# EAGLE design lithium (EAGLE 7.7.0)
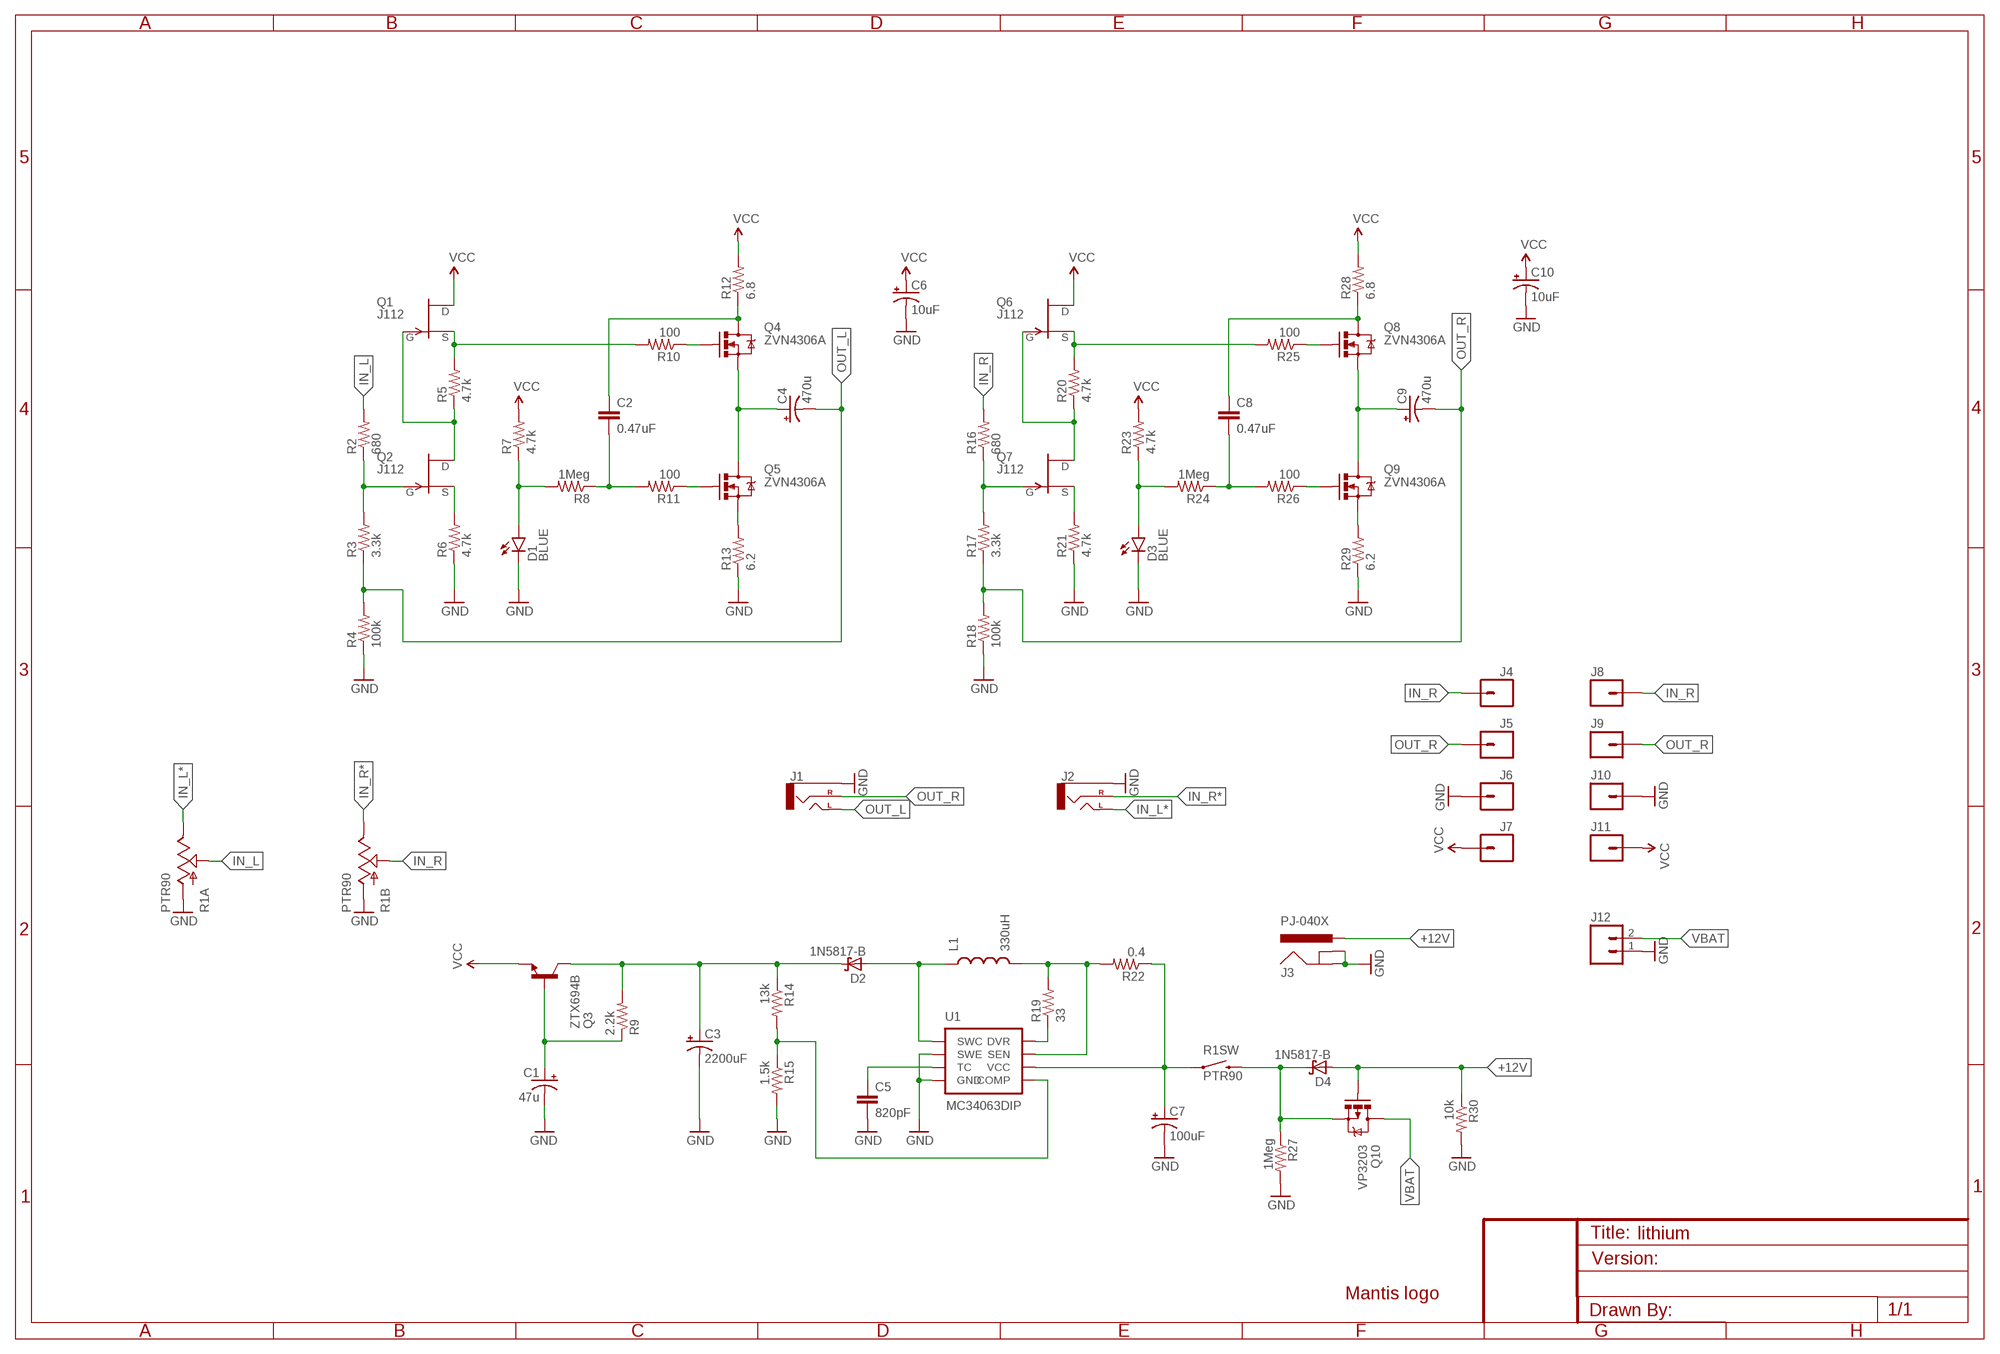
[diagram p0: schematic, sheet 1]

## Parts
C1  47u  CAP_POLPTH1-SM  [CPOL-RADIAL-10UF-25V-SM]
C2  0.47uF  C5/3.5  [C5B3.5]
C3  2200uF  CAP_POLPTH4  [CPOL-RADIAL-1000UF-25V]
C4  470u  CAP_POLPTH8MM  [CPOL-RADIAL-8/3.5]
C5  820pF  CAPPTH  [CAP-PTH-SMALL]
C6  10uF  CAP_POLPTH1-SM  [CPOL-RADIAL-10UF-25V-SM]
C7  100uF  CAP_POLPTH1  [CPOL-RADIAL-100UF-25V]
C8  0.47uF  C5/3.5  [C5B3.5]
C9  470u  CAP_POLPTH8MM  [CPOL-RADIAL-8/3.5]
C10  10uF  CAP_POLPTH1-SM  [CPOL-RADIAL-10UF-25V-SM]
D1  BLUE  LED3MM-SM  [LED3MM-SM]
D2  1N5817-B  [DO41-7.6]
D3  BLUE  LED3MM-SM  [LED3MM-SM]
D4  1N5817-B  [DO41-7.6]
J1  AUDIO-JACKPTH  [AUDIO-JACK]
J2  AUDIO-JACKPTH  [AUDIO-JACK]
J3  PJ-040X  [PJ-040X]
J4  M01PTH  [1X01]
J5  M01PTH  [1X01]
J6  M01PTH  [1X01]
J7  M01PTH  [1X01]
J8  M01PTH  [1X01]
J9  M01PTH  [1X01]
J10  M01PTH  [1X01]
J11  M01PTH  [1X01]
J12  M02PTH  [1X02]
L1  330uH  INDUCTORRLB0912  [RLB0912]
LOGO1  LOGO-MANTIS  [LOGO-MANTIS]
Q1  J112  [TO-92]
Q2  J112  [TO-92]
Q3  ZTX694B  [TO-92]
Q4  ZVN4306A  [TO-92]
Q5  ZVN4306A  [TO-92]
Q6  J112  [TO-92]
Q7  J112  [TO-92]
Q8  ZVN4306A  [TO-92]
Q9  ZVN4306A  [TO-92]
Q10  VP3203  [TO-92]
R1  PTR90  [PTR902]
R2  680  RESISTORPTH-1/4W-SM  [AXIAL-0.4-SM]
R3  3.3k  RESISTORPTH-1/4W-SM  [AXIAL-0.4-SM]
R4  100k  RESISTORPTH-1/4W-SM  [AXIAL-0.4-SM]
R5  4.7k  RESISTORPTH-1/4W-SM  [AXIAL-0.4-SM]
R6  4.7k  RESISTORPTH-1/4W-SM  [AXIAL-0.4-SM]
R7  4.7k  RESISTORPTH-1/4W-SM  [AXIAL-0.4-SM]
R8  1Meg  RESISTORPTH-1/4W-SM  [AXIAL-0.4-SM]
R9  2.2k  RESISTORPTH-1/4W-SM  [AXIAL-0.4-SM]
R10  100  RESISTORPTH-1/4W-SM  [AXIAL-0.4-SM]
R11  100  RESISTORPTH-1/4W-SM  [AXIAL-0.4-SM]
R12  6.8  RESISTORPTH-1/4W-SM  [AXIAL-0.4-SM]
R13  6.2  RESISTORPTH-1/4W-SM  [AXIAL-0.4-SM]
R14  13k  RESISTORPTH-1/4W-SM  [AXIAL-0.4-SM]
R15  1.5k  RESISTORPTH-1/4W-SM  [AXIAL-0.4-SM]
R16  680  RESISTORPTH-1/4W-SM  [AXIAL-0.4-SM]
R17  3.3k  RESISTORPTH-1/4W-SM  [AXIAL-0.4-SM]
R18  100k  RESISTORPTH-1/4W-SM  [AXIAL-0.4-SM]
R19  33  RESISTORPTH-1/4W-SM  [AXIAL-0.4-SM]
R20  4.7k  RESISTORPTH-1/4W-SM  [AXIAL-0.4-SM]
R21  4.7k  RESISTORPTH-1/4W-SM  [AXIAL-0.4-SM]
R22  0.4  RESISTORPTH-1/4W-SM  [AXIAL-0.4-SM]
R23  4.7k  RESISTORPTH-1/4W-SM  [AXIAL-0.4-SM]
R24  1Meg  RESISTORPTH-1/4W-SM  [AXIAL-0.4-SM]
R25  100  RESISTORPTH-1/4W-SM  [AXIAL-0.4-SM]
R26  100  RESISTORPTH-1/4W-SM  [AXIAL-0.4-SM]
R27  1Meg  RESISTORPTH-1/4W-SM  [AXIAL-0.4-SM]
R28  6.8  RESISTORPTH-1/4W-SM  [AXIAL-0.4-SM]
R29  6.2  RESISTORPTH-1/4W-SM  [AXIAL-0.4-SM]
R30  10k  RESISTORPTH-1/4W-SM  [AXIAL-0.4-SM]
U1  MC34063DIP  [DIP-08]

## Nets
+12V [pwr]: D4.A J3.1(PWR) Q10.2(G) R30.P$1
GND: C1.2(-) C3.- C5.2 C6.2(-) C7.2(-) C10.2(-) D1.K(C) D3.K(C) J1.SLEEVE J2.SLEEVE J3.2(GND) J3.3(GNDBREAK) J6.1 J10.1 J12.1 R1.R1.1(A:A) R1.R2.1(B:A) R4.P$1 R6.P$1 R13.P$1 R15.P$2 R18.P$1 R21.P$1 R27.P$2 R29.P$1 R30.P$2 U1.2(SWE) U1.4(GND)
IN_L: R1.R1.2(A:S) R2.P$2
IN_L*: J2.TIP(LEFT) R1.R1.3(A:E)
IN_R: J4.1 J8.1 R1.R2.2(B:S) R16.P$2
IN_R*: J2.RING(RIGHT) R1.R2.3(B:E)
N$1: Q1.2(S) R5.P$2 R10.P$2
N$2: Q1.3(G) Q2.1(D) R5.P$1
N$3: Q2.2(S) R6.P$2
N$4: Q6.2(S) R20.P$2 R25.P$2
N$5: Q4.2(G) R10.P$1
N$6: Q2.3(G) R2.P$1 R3.P$2
N$7: Q6.3(G) Q7.1(D) R20.P$1
N$8: Q5.2(G) R11.P$1
N$9: C5.1 U1.3(TC)
N$10: Q5.1(S) R13.P$2
N$11: C2.1 Q4.3(D) R12.P$1
N$12: Q7.2(S) R21.P$2
N$13: C2.2 R8.P$1 R11.P$2
N$14: D1.A R7.P$1 R8.P$2
N$15: Q7.3(G) R16.P$1 R17.P$2
N$16: Q8.2(G) R25.P$1
N$17: Q9.2(G) R26.P$1
N$18 [pwr]: R19.P$1 U1.8(DVR)
N$19: Q9.1(S) R29.P$2
N$20: C8.1 Q8.3(D) R28.P$1
N$21: C8.2 R24.P$1 R26.P$2
N$22: D3.A R23.P$1 R24.P$2
N$23 [pwr]: C7.1(+) R1.SW1 R22.P$1 U1.6(VCC)
N$24: C1.1(+) Q3.2(B) R9.P$1
N$25 [pwr]: D2.A L1.1 U1.1(SWC)
N$26 [pwr]: L1.2 R19.P$2 R22.P$2 U1.7(SEN)
N$28: R14.P$2 R15.P$1 U1.5(COMP)
N$29 [pwr]: D4.C Q10.1(S) R1.SW2 R27.P$1
OUT_L: C4.2(-) J1.TIP(LEFT) R3.P$1 R4.P$2
OUT_L*: C4.1(+) Q4.1(S) Q5.3(D)
OUT_R: C9.2(-) J1.RING(RIGHT) J5.1 J9.1 R17.P$1 R18.P$2
OUT_R*: C9.1(+) Q8.1(S) Q9.3(D)
VBAT [pwr]: J12.2 Q10.3(D)
VCC [pwr]: C6.1(+) C10.1(+) J7.1 J11.1 Q1.1(D) Q3.1(E) Q6.1(D) R7.P$2 R12.P$2 R23.P$2 R28.P$2
VSMPS [pwr]: C3.+ D2.C Q3.3(C) R9.P$2 R14.P$1

## Library data of the parts
C1 C4 C6 C9 C10 = my-cap:CAP_POL: Capacitor Polarized These are standard SMD and PTH capacitors. Normally 10uF, 47uF, and 100uF in electrolytic and tantalum varieties. Always verify the external diameter of the through hole cap, it varies with capacity, voltage, and manufacturer. The EIA devices should be standard.
C2 C8 = capacitor-wima:C: CAPACITOR naming: grid - package width
C3 C7 = SparkFun-Capacitors:CAP_POL: Capacitor Polarized These are standard SMD and PTH capacitors. Normally 10uF, 47uF, and 100uF in electrolytic and tantalum varieties. Always verify the external diameter of the through hole cap, it varies with capacity, voltage, and manufacturer. The EIA devices should be standard.
C5 = SparkFun-Capacitors:CAP: Capacitor Standard 0603 ceramic capacitor, and 0.1" leaded capacitor.
D1 D3 = my:LED: LEDs Standard schematic elements and footprints for 5mm, 3mm, 1206, and 0603 sized LEDs. 5mm - Spark Fun Electronics SKU : COM-00529 (and others)
D2 D4 = diode:1N581*: 1.0A SCHOTTKY BARRIER RECTIFIER Source: http://www.diodes.com/datasheets/ds23001.pdf
J1 J2 = SparkFun-Connectors:AUDIO-JACK: 3.5mm Audio Jack Simple 3.5mm common PCB mount audio jack. Variant PTH is our storefront SKU PRT-08032
J3 = my-conn:PJ-040X: CUI PJ-040x 3.8mm power jack
J4-J11 = SparkFun-Connectors:M01: Header 1 Standard 1-pin 0.1" header. Use with straight break away headers (SKU : PRT-00116), right angle break away headers (PRT-00553), swiss pins (PRT-00743), machine pins (PRT-00117), and female headers (PRT-00115). SMTSO-256-ET is a "flush mount" nut for a 4-40 screw. The older package used to be too tight, and did not allow it to sit properly thru the drill hit. The latest (0.165DIA) fits nice and snug.
J12 = SparkFun-Connectors:M02: Standard 2-pin 0.1" header. Use with - straight break away headers ( PRT-00116) - right angle break away headers (PRT-00553) - swiss pins (PRT-00743) - machine pins (PRT-00117) - female headers (PRT-00115) Molex polarized connector foot print use with: PRT-08233 with associated crimp pins and housings. 2.54_SCREWTERM for use with PRT-10571. 3.5mm Screw Terminal footprints for PRT-08084 5mm Screw Terminal footprints for use with PRT-08432
L1 = SparkFun-Passives:INDUCTOR: Inductors Basic Inductor/Choke - 0603 and 1206. Footprints are not proven and vary greatly between part numbers. INDUCTOR POWER 3.3UH 4.0A SMD 0.197" L x 0.197" W x 0.177" H (5.00mm x 5.00mm x 4.50mm)
LOGO1 = my:LOGO-MANTIS: Mantis logo
Q1 Q2 Q6 Q7 = my-tran:J112
Q3 = my-tran:ZTX694B: NPN TRANSISTOR
Q4 Q5 Q8 Q9 = my-tran:ZVN4306A
Q10 = my-tran:VP3203: P-Channel Enhancement-Mode Vertical DMOS FET
R1 = my:PTR90: PTD90 Series - 9 mm Multi-Ganged Potentiometer
R2-R30 = my-res:RESISTOR: Resistor Basic schematic elements and footprints for 0603, 1206, and PTH resistors.
U1 = SparkFun-PowerIC:MC34063: Jellybean switching supply controller

## Net classes
1 pwr: width 0.61 mm

## Board
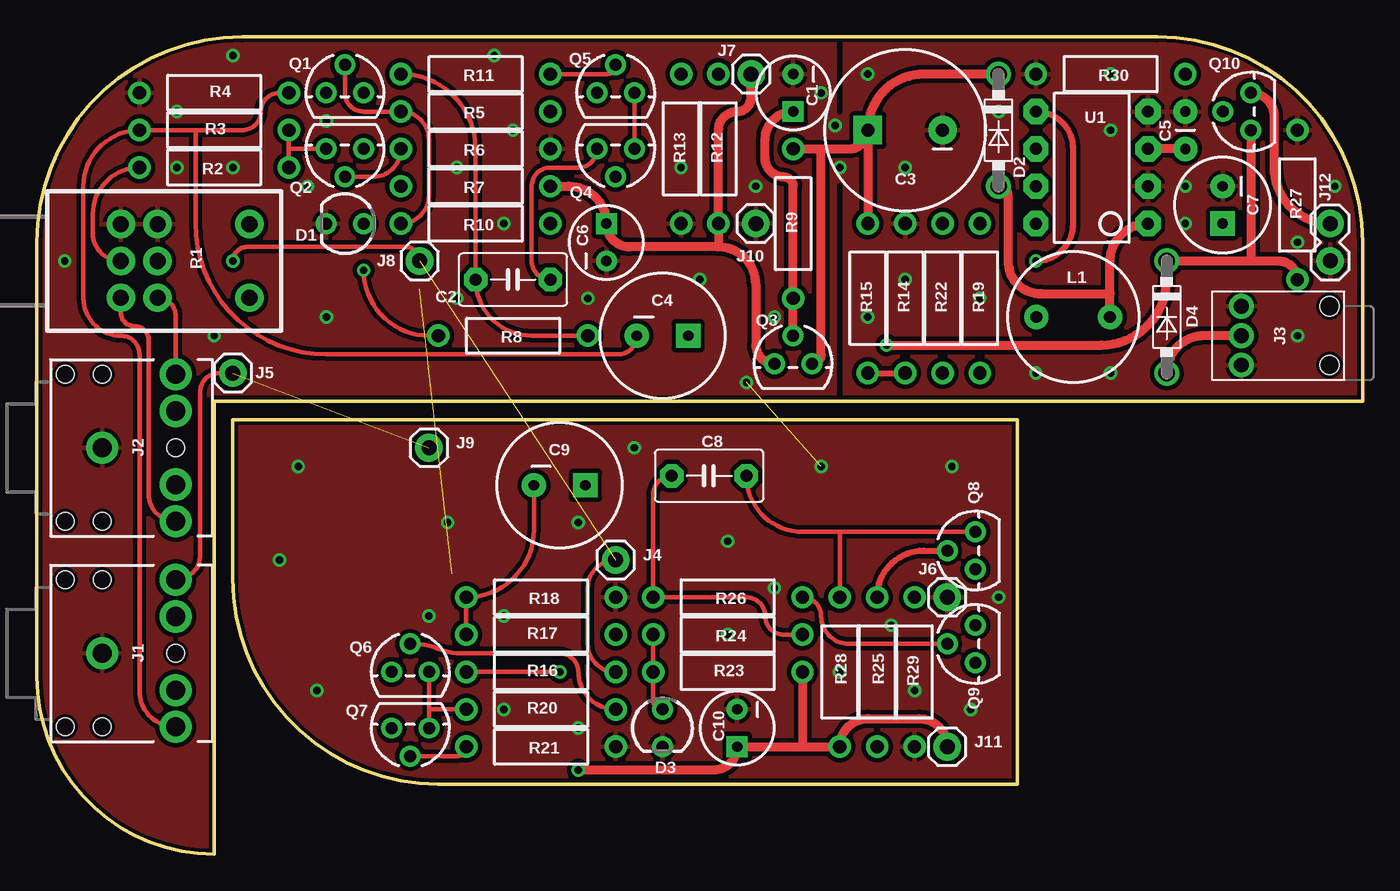
[diagram p1: board, top side]
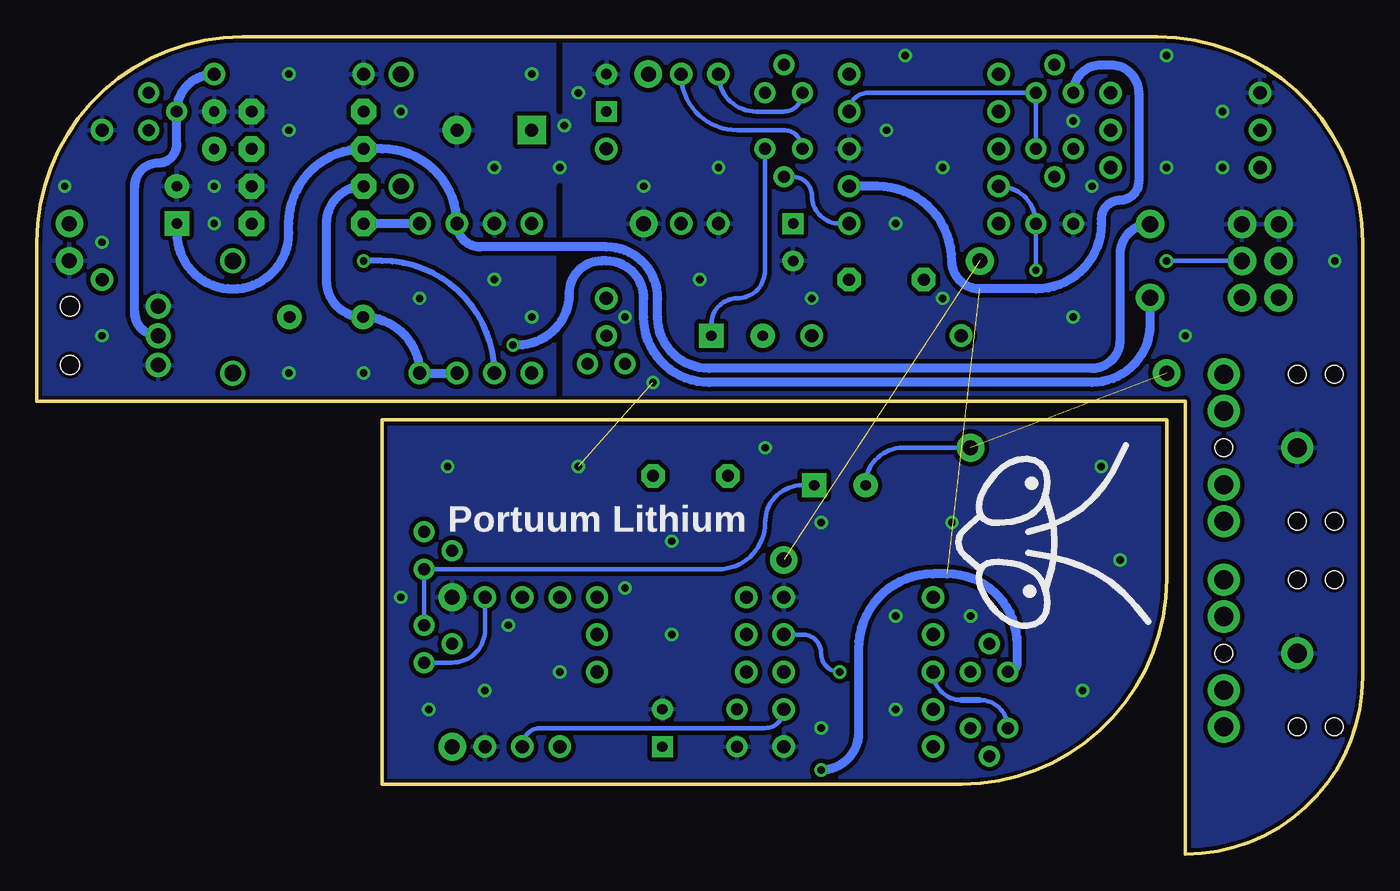
[diagram p2: board, bottom side, seen from below]

Size 90.17 x 55.56 mm. Coordinates in mm from the lower left corner, seen from the top.
Outline: 90.17,30.8 90.17,41.59 arc90 76.2,55.56 13.97,55.56 arc90 0,41.59 0,12.07 arc90 12.06,0 12.06,30.8 90.17,30.8
Outline: 66.67,4.76 27.3,4.76 arc-90 13.34,18.73 13.34,29.53 66.67,29.53 66.67,4.76
Copper layers (1*16): Top 0.035mm / dielectric 1.5mm / Bottom 0.035mm
Design rules "SeeedStudio_2layer_DRU_no_angle_20140221 *": minimum track width 6mil, minimum drill 12mil, track to track 12mil, track to pad 12mil, pad to pad 12mil, via to via 12mil, smd to smd 0mil, copper to edge 10mil, drill to drill 12mil, minimum pad ring 10mil, minimum via ring 8mil, stop-mask expansion 2mil, vias tented up to drill 100mil, thermal gap 10mil
tRestrict: 2 lines
bRestrict: 2 lines

### Footprints (pad centres in the part's own frame; a part is rotated, then mirrored left to right if it is on the bottom)
CPOL-RADIAL-10UF-25V-SM = drill 0.7 pad 1.422 square: 1 1.27,0 | drill 0.7 pad 1.422: 2 -1.27,0
C5B3.5 = drill 0.813 pad 1.6 octagon: 1 -2.54,0; 2 2.54,0
CPOL-RADIAL-1000UF-25V = drill 0.9 pad 1.93 square: + 2.54,0 | drill 0.9 pad 1.93: - -2.54,0
CPOL-RADIAL-8/3.5 = drill 0.7 pad 1.651 square: 1 1.75,0 | drill 0.7 pad 1.651: 2 -1.75,0
CAP-PTH-SMALL = drill 0.7 pad 1.651: 1 0,0; 2 2.54,0
CPOL-RADIAL-100UF-25V = drill 0.7 pad 1.651 square: 1 1.27,0 | drill 0.7 pad 1.651: 2 -1.27,0
LED3MM-SM = drill 0.813 pad 1.422: A -1.27,0; K 1.27,0
DO41-7.6 = drill 1.1 pad 1.7: A 3.81,0; C -3.81,0
AUDIO-JACK = drill 1.3 pad 2.184: RING 5,5; RSH 5,2.5; SLEEVE 0,0; TIP 5,-5; TSH 5,-2.5 | hole 1.2: 0,5; -2.5,5; -2.5,-5; 0,-5; 5,0
PJ-040X = drill 1 pad 1.676: 1 0,0; 2 0,-2; 3 0,2 | hole 1.3: -6,2; -6,-2
1X01 = drill 1.016 pad 1.88: 1 0,0
1X02 = drill 1.016 pad 1.88: 1 0,0; 2 2.54,0
RLB0912 = drill 0.813 pad 1.651: 1 2.502,0; 2 -2.502,0
TO-92 = drill 0.813 pad 1.422: 1 -1.27,0; 2 0,1.905; 3 1.27,0
PTR902 = drill 1.1 pad 1.93: R1.1 0,-2.5; R1.2 0,0; R1.3 0,2.5; R2.1 -2.5,-2.5; R2.2 -2.5,0; R2.3 -2.5,2.5; SW1 -8.75,-2.5; SW2 -8.75,2.5
AXIAL-0.4-SM = drill 0.9 pad 1.524: P$1 -5.08,0; P$2 5.08,0
DIP-08 = drill 0.813 pad 1.727 octagon: 1 -3.81,-3.81; 2 -1.27,-3.81; 3 1.27,-3.81; 4 3.81,-3.81; 5 3.81,3.81; 6 1.27,3.81; 7 -1.27,3.81; 8 -3.81,3.81

### Placement (x,y rotation side)
C1  51.44,51.75 270 top
C2  32.39,39.05 180 top
C3  59.05,49.21 180 top
C4  42.55,35.24 0 top
C5  78.1,47.94 90 top
C6  38.73,41.59 90 top
C7  80.64,44.13 270 top
C8  45.72,25.72 180 top
C9  35.56,25.08 0 top
C10  47.62,8.57 270 top
D1  20.95,42.86 180 top
D2  65.41,49.21 270 top
D3  42.55,8.57 270 top
D4  76.83,36.51 270 top
J1  4.45,13.65 0 top
J2  4.45,27.62 0 top
J3  81.91,35.24 180 top
J4  39.37,20 0 top
J5  13.34,32.7 0 top
J6  61.91,17.46 0 top
J7  48.58,53.02 0 top
J8  26.04,40.32 0 top
J9  26.67,27.62 0 top
J10  48.9,42.86 0 top
J11  61.91,7.3 0 top
J12  87.95,40.32 90 top
L1  70.48,36.51 0 top
LOGO1  20.95,21.27 270 bottom
Q1  20.95,51.75 0 top
Q2  20.95,47.94 180 top
Q3  51.44,33.34 0 top
Q4  39.37,47.94 180 top
Q5  39.37,51.75 0 top
Q6  25.4,12.38 0 top
Q7  25.4,8.57 180 top
Q8  63.82,20.64 90 top
Q9  63.82,14.29 90 top
Q10  82.55,50.48 90 top
R1  5.71,40.32 180 top
R2  12.06,46.67 180 top
R3  12.06,49.21 0 top
R4  12.06,51.75 0 top
R5  29.84,50.48 180 top
R6  29.84,47.94 180 top
R7  29.84,45.4 0 top
R8  32.39,35.24 180 top
R9  51.44,42.86 90 top
R10  29.84,42.86 180 top
R11  29.84,53.02 180 top
R12  46.36,47.94 270 top
R13  43.82,47.94 90 top
R14  56.52,37.78 270 top
R15  59.05,37.78 90 top
R16  34.29,12.38 0 top
R17  34.29,14.92 0 top
R18  34.29,17.46 180 top
R19  64.13,37.78 270 top
R20  34.29,9.84 0 top
R21  34.29,7.3 180 top
R22  61.59,37.78 270 top
R23  46.99,12.38 0 top
R24  46.99,14.92 180 top
R25  57.15,12.38 270 top
R26  46.99,17.46 180 top
R27  85.72,44.13 90 top
R28  54.61,12.38 270 top
R29  59.69,12.38 90 top
R30  73.02,53.02 180 top
U1  71.75,46.67 90 top

### Tracks (layer width: path | path; a pad name or v marks a point on that pad's centre or on a via)
+12V
  Top 0.61: J3.1 79.38,35.24 arc90 D4.A
  Bottom 0.61: J3.1 arc90 83.5,36.83 83.5,45.4 arc90 81.91,46.99 arc-90 80.64,48.26 Q10.2 arc90 R30.P$1
GND  (via drill 0.5)  (1 unrouted)
  other vias: 19.68,36.51 13.34,54.29 9.53,50.48 9.53,46.67 13.34,46.67 12.06,35.24 1.91,40.32 28.57,37.78 37.47,37.78 45.09,39.05 43.82,46.67 48.9,45.4 32.39,49.21 28.57,46.67 31.11,54.29 53.34,51.75 56.52,53.02 59.05,46.67 78.1,45.4 78.1,42.86 73.02,49.21 73.02,53.02 64.13,37.78 59.05,39.05 56.52,36.51 67.94,32.7 73.02,32.7 85.72,35.24 88.27,45.4 65.41,50.48 19.05,11.11 17.78,26.35 27.94,22.54 16.51,20 36.83,22.54 40.64,27.62 53.34,26.35 62.23,26.35 46.99,21.27 46.99,14.92 50.16,18.1 54.61,12.38 63.5,9.84 65.41,17.46 59.69,11.11 58.1,15.56 36.83,8.57 31.75,9.84 31.75,16.19 26.67,16.19 18.41,45.4 19.68,49.85 31.75,42.86 48.26,32.07 50.16,36.51 54.61,46.67 54.29,49.53 85.72,41.59
  pour Top: -0.64,82.23 90.8,82.23 90.8,-0.32 -0.64,-0.32
  pour Bottom: -0.64,82.23 90.8,82.23 90.8,-0.32 -0.64,-0.32
IN_L
  Top 0.305: R1.R1.2 arc-90 3.81,42.23 3.81,43.5 arc-90 R2.P$2
IN_L*
  Top 0.305: J2.TIP arc-90 7.62,24.45 7.62,34.92 arc90 6.67,35.88 arc-90 5.71,36.83 R1.R1.3
IN_R  (via drill 0.5)  (1 unrouted)
  Top 0.305: R16.P$2 arc-90 37.47,14.29 37.47,18.1 arc-90 J4.1 | J8.1 arc90 25.08,41.28 14.29,41.28 arc90 v13.34,40.32
  Bottom 0.305: v13.34,40.32 R1.R2.2
IN_R*
  Top 0.305: J2.RING 9.45,36.59 arc90 R1.R2.3
N$1
  Top 0.305: R10.P$2 arc90 26.67,44.77 26.67,48.58 arc90 R5.P$2 22.22,50.48 arc-90 20.95,51.75 Q1.2
N$2
  Bottom 0.305: Q2.1 Q1.3 33.66,51.75 arc-90 R5.P$1
N$3
  Top 0.305: Q2.2 22.86,46.04 arc90 R6.P$2
N$4
  Top 0.305: 25.72,14.29 arc-23 27.3,13.97 arc26 29.21,13.65 35.56,13.65 arc-90 36.83,12.38 arc90 R20.P$2
  Top 0.406: Q6.2 25.72,14.29
  Bottom 0.305: R20.P$2 arc90 40.64,8.57 55.88,8.57 arc-90 R25.P$2
N$5
  Bottom 0.305: R10.P$1 35.56,42.86 arc90 37.47,44.77 arc-90 38.73,46.04 Q4.2
N$6
  Top 0.305: R3.P$2 17.14,47.94 | 17.14,47.94 R2.P$1 | Q2.3 17.14,47.94
N$7
  Top 0.305: Q6.3 26.67,9.84 | 26.67,9.84 Q7.1 | R20.P$1 26.67,9.84
N$8
  Top 0.305: R11.P$1 38.73,53.02 arc90 Q5.2
N$9
  Top 0.61: C5.1 U1.3
N$10
  Bottom 0.305: Q5.1 arc90 39.37,50.48 41.27,50.48 arc90 R13.P$2
N$11
  Top 0.305: Q4.3 arc-90 36.83,46.67 34.93,46.67 arc90 33.66,45.4 33.66,40.32 arc90 C2.1
  Bottom 0.305: Q4.3 arc-90 39.37,49.21 42.55,49.21 arc90 R12.P$1
N$12
  Top 0.305: Q7.2 28.57,6.67 arc90 R21.P$2
N$13
  Top 0.305: R8.P$1 33.66,35.24 arc-90 C2.2 29.84,47.94 arc90 R11.P$2
N$14  (via drill 0.5)
  Top 0.305: v22.22,39.69 arc90 26.67,35.24 R8.P$2
  Bottom 0.305: v22.22,39.69 D1.A arc-90 R7.P$1
N$15  (via drill 0.5)
  Top 0.305: v35.56,12.38 R16.P$1
  Bottom 0.305: Q7.3 arc-90 26.04,10.48 | 27.3,10.48 arc90 R16.P$1 | v35.56,12.38 arc90 36.83,13.65 arc-90 38.1,14.92 R17.P$2
  Bottom 0.406: 26.04,10.48 27.3,10.48
N$16
  Top 0.406: R25.P$1 arc-90 60.33,20.64 Q8.2
N$17
  Top 0.305: R26.P$1 arc-90 53.34,16.19 arc90 55.25,14.29 Q9.2
N$18
  Bottom 0.61: R19.P$1 U1.8
N$19
  Bottom 0.305: R29.P$2 59.69,15.24 arc90 61.91,13.02 Q9.1
N$20
  Top 0.305: C8.1 arc90 52.07,21.91 54.61,21.91 | 54.61,21.91 Q8.3 | R28.P$1 54.61,21.91
N$21
  Top 0.305: R24.P$1 50.8,14.92 arc-90 49.53,16.19 arc90 48.26,17.46 R26.P$2 41.91,24.45 arc-90 C8.2
N$22
  Top 0.305: R24.P$2 R23.P$1 41.91,10.48 arc90 D3.A
N$23
  Bottom 0.61: R1.SW1 arc-90 16.51,40.78 16.51,34.92 arc90 18.41,33.02 44.45,33.02 arc90 47.94,36.51 47.94,37.78 arc-90 51.44,41.28 60.01,41.28 arc90 R22.P$1 arc-90 66.67,47.94 U1.6 arc-90 73.02,42.86 73.02,42.23 arc90 76.83,38.42 arc90 80.64,42.23 C7.1
N$24
  Top 0.61: Q3.2 R9.P$1 51.44,45.4 arc90 50.8,46.04 arc-90 49.53,47.31 49.53,48.58 arc-90 C1.1
N$25
  Top 0.61: L1.1 72.99,38.1 | 72.99,38.1 72.99,40.28 arc-90 U1.1 | D2.A arc-90 66.04,44.77 66.04,40.32 arc90 68.26,38.1 72.99,38.1
N$26
  Top 0.61: 67.94,36.51 L1.2
  Bottom 0.61: U1.7 arc-90 70.48,42.86 70.48,39.01 arc-90 L1.2 67.94,36.51 arc90 R19.P$2 R22.P$2
N$28  (via drill 0.5)
  Top 0.406: R14.P$2 R15.P$1 | v67.94,40.32 arc90 70.48,42.86 70.48,47.94 arc90 U1.5
  Bottom 0.406: R15.P$1 arc-90 66.67,40.32 v67.94,40.32
N$29  (via drill 0.5)
  Top 0.61: 82.55,40.32 D4.C 76.83,39.05 arc-90 72.39,34.61 v57.79,34.61 | 82.55,40.32 84.45,40.32 arc-90 R27.P$1 | Q10.1 82.55,40.32
  Bottom 0.61: R1.SW2 14.46,36.02 arc90 18.41,32.07 44.45,32.07 arc90 48.9,36.51 48.9,37.78 arc-90 51.44,40.32 51.75,40.32 arc-90 53.98,38.1 arc90 57.47,34.61 v57.79,34.61
OUT_L
  Top 0.305: J1.TIP arc-90 6.99,11.11 6.99,33.97 arc90 5.71,35.24 arc-90 3.17,37.78 3.17,45.4 arc-90 R3.P$1 10.79,49.21 | 10.79,49.21 13.97,49.21 arc90 15.24,50.48 arc-90 16.51,51.75 R4.P$2 | C4.2 arc-90 39.52,33.97 19.68,33.97 arc-90 10.79,42.86 10.79,49.21
OUT_L*
  Top 0.305: Q4.1 Q5.3
  Bottom 0.305: Q4.1 40.64,39.69 arc90 42.55,37.78 arc-90 44.3,36.03 C4.1
OUT_R  (1 unrouted)
  Top 0.305: C9.2 33.81,22.06 arc-90 R18.P$2 R17.P$1 | J1.RING arc90 11.11,20.32 11.11,31.43 arc-90 12.38,32.7 J5.1
  Bottom 0.305: J9.1 31.27,27.62 arc-90 C9.2
OUT_R*
  Bottom 0.305: Q9.3 Q8.1 43.82,19.37 arc-90 40.64,22.54 arc90 38.1,25.08 C9.1
VBAT
  Top 0.61: Q10.3 arc-90 84.14,50.17 84.14,46.67 arc90 J12.2
VCC  (via drill 0.5)  (1 unrouted)
  Top 0.61: Q3.1 arc-90 48.9,34.61 48.9,38.74 arc90 46.36,41.28 | R7.P$2 36.2,45.4 arc-90 C6.1 arc90 40.32,41.28 46.36,41.28 | 52.07,7.3 C10.1 arc-90 46.04,5.71 v36.83,5.71 | 52.07,7.3 R28.P$2 arc-90 56.52,9.21 60.01,9.21 arc-90 J11.1 | R23.P$2 52.07,7.3 | 46.36,41.28 R12.P$2 46.36,49.21 arc-90 47.62,50.48 arc90 48.58,51.43 J7.1
  Bottom 0.61: Q6.1 arc-90 23.49,13.02 23.49,14.29 arc-90 28.26,19.05 29.21,19.05 arc-90 34.29,13.97 34.29,8.25 arc90 v36.83,5.71 | Q1.1 arc90 17.78,53.66 17.14,53.66 arc90 15.24,51.75 15.24,45.72 arc90 16.51,44.45 arc-90 17.78,43.18 17.78,42.86 arc90 22.22,38.42 26.04,38.42 arc90 27.94,40.32 arc-90 33.02,45.4 R7.P$2
VSMPS
  Top 0.61: D2.C 60.33,53.02 arc90 C3.+ | C3.+ R14.P$1 | 53.34,47.94 55.25,47.94 arc90 C3.+ | Q3.3 arc90 53.34,33.97 53.34,47.94 | R9.P$2 53.34,47.94

### Text on the board
bPlace: Portuum Lithium